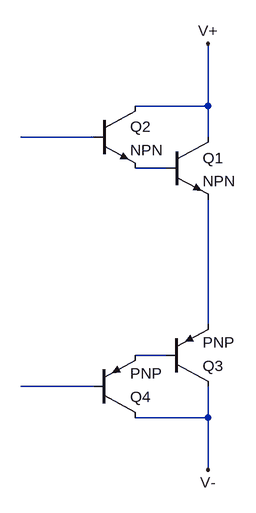
[diagram p0: schematic darlington_coupling.asc]
darlington_coupling.asc, the LTspice schematic file:
Version 4
SHEET 1 880 680
WIRE 288 32 288 -64
WIRE 288 32 176 32
WIRE 112 80 0 80
WIRE 288 80 288 32
WIRE 224 128 176 128
WIRE 288 368 288 176
WIRE 224 416 176 416
WIRE 112 464 0 464
WIRE 288 512 288 464
WIRE 288 512 176 512
WIRE 288 592 288 512
FLAG 288 -64 V+
FLAG 288 592 V-
SYMBOL npn 224 80 R0
SYMATTR InstName Q1
SYMBOL npn 112 32 R0
SYMATTR InstName Q2
SYMBOL pnp 224 464 M180
SYMATTR InstName Q3
SYMBOL pnp 112 512 M180
SYMATTR InstName Q4

The netlist it stands for:
* darlington_coupling.asc
Q1 V+ N002 N003 0 NPN
Q2 V+ N001 N002 0 NPN
Q3 V- N004 N003 0 PNP
Q4 V- N005 N004 0 PNP
.model NPN NPN
.model PNP PNP
.lib standard.bjt
.backanno
.end